# Altium project AP33771.PrjPcb
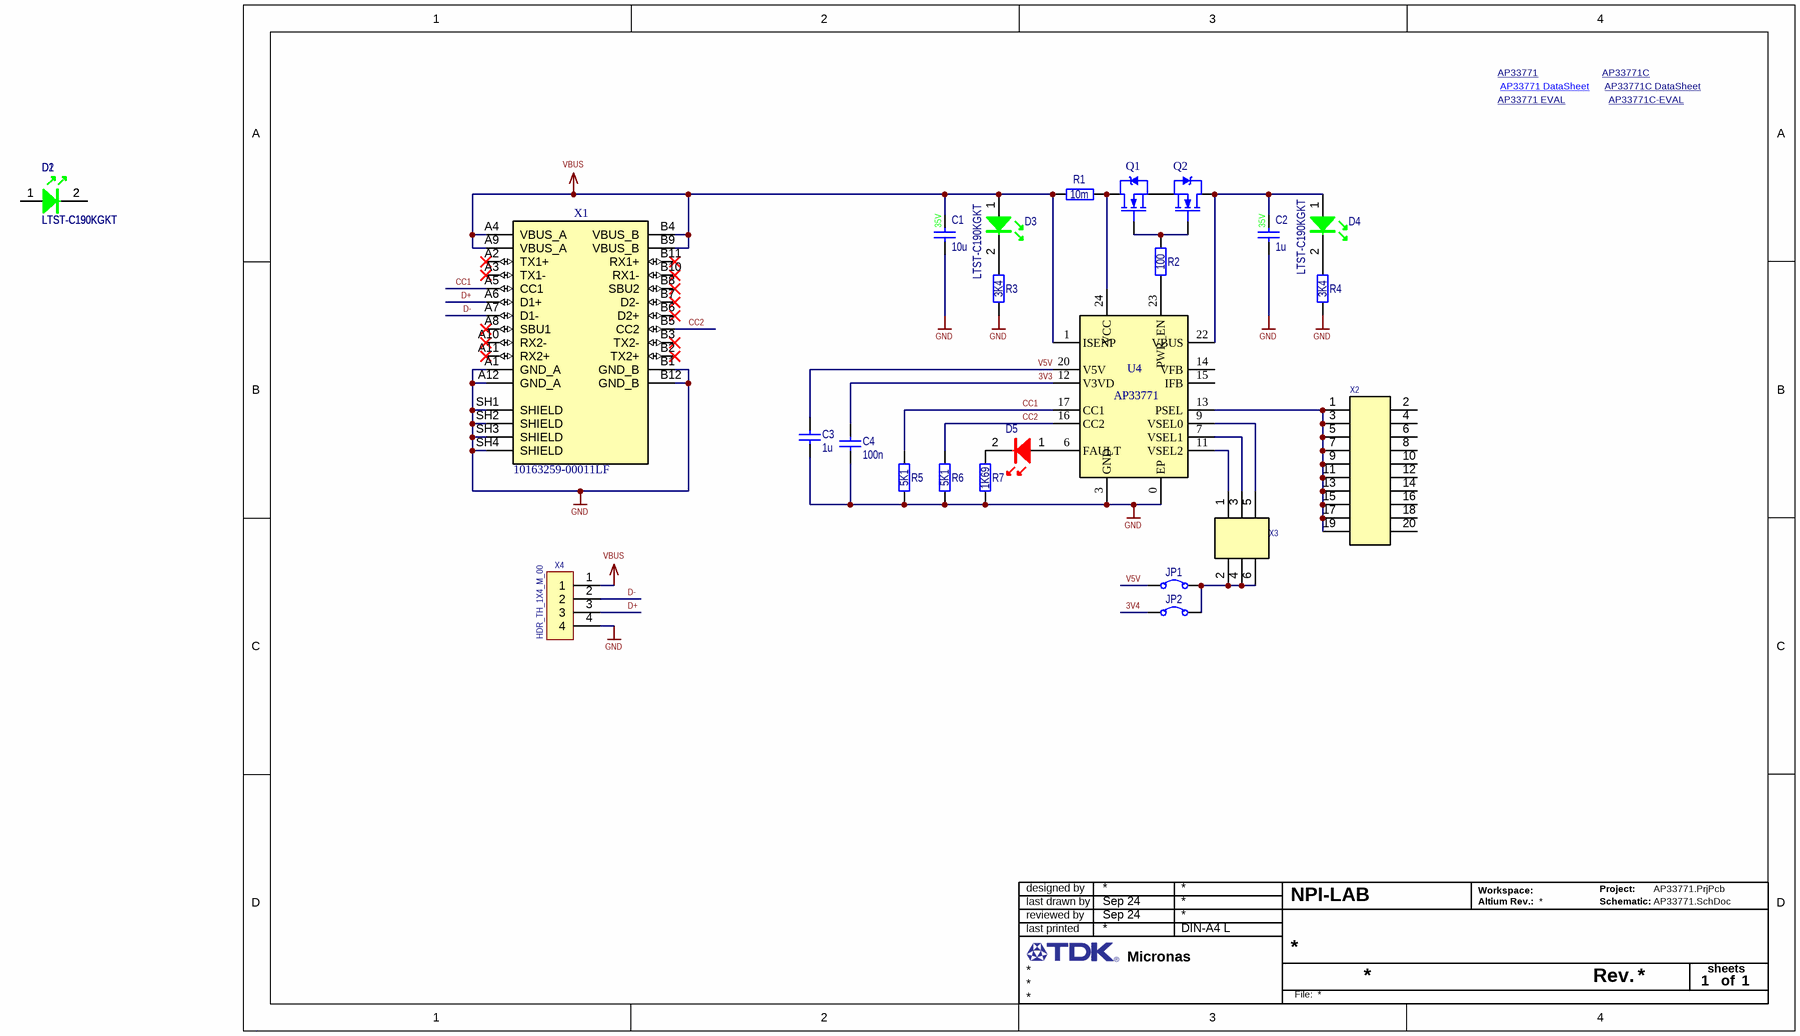
[diagram p0: AP33771.SchDoc]
companyName: Micronas; Date_Designed: May 2024; Date_Drawn: May 2024; Date_Engineer: Sep 24; Date_Reviewed: June 2024; DateChecked: Sep 24; DateDraw: Sep 24; Draftsman: Hören; Engineer_Desing: nerohmot; Engineer_Drawn: nerohmot; Engineer_Review: heli2src; organization: NPI-LAB; Project_Title: Babel Box
1 sheet, 25 parts. Net scope: global (net labels, ports and power ports of the same name join across sheets).
Board file: AP33771.PcbDoc

## Sheet AP33771.SchDoc
size A4; SheetNumber: 1; SheetTotal: 1

### Parts
C1  35V  value 10u  [CAPC0603]
C2  35V  value 1u  [CAPC0603]
C3  value 1u  [CAPC0402]  (hidden comment: CL05A105KP5NNNC)
C4  value 100n  [CAPC0402]  (hidden comment: C0402C104J8RACTU)
D1  LTST-C190KGKT  [LED0603G]
D2  LTST-C190KGKT  [LED0603G]
D3  LTST-C190KGKT  [LED0603G]
D4  LTST-C190KGKT  [LED0603G]
D5  LTST-C190KGKT  [LED0603R]  (value not drawn)
JP1  5110 Keystone  [JumperSMD_0603]  (value not drawn)  (no BOM)
JP2  5110 Keystone  [JumperSMD_0603]  (value not drawn)  (no BOM)
Q1  DMN3008SFG  [PowerDI3333-8]  (value not drawn)
Q2  DMN3008SFG  [PowerDI3333-8]  (value not drawn)
R1  value 10m  [RESC1206]  (hidden comment: 10m_1206_63mW_1%_100ppm_1)
R2  value 100  [RESC0402]  (hidden comment: 100R_0402_63mW_1%_100ppm_1)
R3  value 3K4  [RESC0402]  (hidden comment: 3K4_0402_63mW_1%_100ppm)
R4  value 3K4  [RESC0402]  (hidden comment: 3K4_0402_63mW_1%_100ppm)
R5  value 5K1  [RESC0402]  (hidden comment: 5K1_0402_63mW_1%_100ppm)
R6  value 5K1  [RESC0402]  (hidden comment: 5K1_0402_63mW_1%_100ppm)
R7  value 1K69  [RESC0402]  (hidden comment: 1K69_0402_63mW_1%_100ppm)
U4  AP33771  [W-QFN4040-24]
X1  value 10163259-00011LF  [10163259-00011LF]  (hidden comment: USBC)
X2  HMTSW-110-07-G-D-240  [HDR_TH_2X10_M_00]  (value not drawn)
X3  HMTSW-103-07-G-D-240  [HDR_TH_2X3_M_00]  (value not drawn)
X4  value HDR_TH_1X4_M_00  [HDR_TH_1X4_M_00]  (hidden comment: HMTSW-104-07-G-S-240)

### Nets
GND: C1.1 C2.1 C3.1 C4.1 R3.1 R4.1 R5.1 R6.1 R7.1 U4.0(EP) U4.3(GND) X1.A1(GND_A) X1.A12(GND_A) X1.B1(GND_B) X1.B12(GND_B) X1.SH1(SHIELD) X1.SH2(SHIELD) X1.SH3(SHIELD) X1.SH4(SHIELD) X4.4
VBUS: C1.2 D3.1(A) R1.1 U4.1(ISENP) X1.A4(VBUS_A) X1.A9(VBUS_A) X1.B4(VBUS_B) X1.B9(VBUS_B) X4.1
3V3: C4.2 U4.12(V3VD)
3V4: JP2.1
CC1: R5.2 U4.17(CC1) X1.A5(CC1)
CC2: R6.2 U4.16(CC2) X1.B5(CC2)
D+: X1.A6(D1+) X4.3
D-: X1.A7(D1-) X4.2
V5V: C3.2 JP1.1 U4.20(V5V)
NetC2_2: C2.2 D4.1(A) Q2.3(D) U4.22(VBUS)
NetD1_1: D1.1(A) D2.1(A)
NetD1_2: D1.2(K) D2.2(K)
NetD3_2: D3.2(K) R3.2
NetD4_2: D4.2(K) R4.2
NetD5_1: D5.1(A) U4.6(FAULT)
NetD5_2: D5.2(K) R7.2
NetJP1_2: JP1.2 JP2.2 X3.2 X3.4 X3.6
NetQ1_1: Q1.1(G) Q2.1(G) R2.2
NetQ1_2: Q1.2(S) Q2.2(S)
NetQ1_3: Q1.3(D) R1.2 U4.24(VCC)
NetR2_1: R2.1 U4.23(PWR_EN)
NetU4_7: U4.7(VSEL1) X3.3
NetU4_9: U4.9(VSEL0) X3.5
NetU4_11: U4.11(VSEL2) X3.1
NetU4_13: U4.13(PSEL) X2.1 X2.3 X2.5 X2.7 X2.9 X2.11 X2.13 X2.15 X2.17 X2.19

Not connected (* = marked no-connect by the designer): U4 14(VFB) 15(IFB); X1 A2(TX1+)* A3(TX1-)* A8(SBU1)* A10(RX2-)* A11(RX2+)* B2(TX2+)* B3(TX2-)* B6(D2+)* B7(D2-)* B8(SBU2)* B10(RX1-)* B11(RX1+)*; X2 2 4 6 8 10 12 14 16 18 20

### Notes on the sheet
- AP33771 <https://www.diodes.com/search/?q=AP33771&t=keyword&action_results=Go>
- AP33771 EVAL <https://www.diodes.com/assets/Evaluation-Boards/AP33771-EVB-User-Guide.pdf>
- AP33771 DataSheet <https://www.diodes.com/assets/Datasheets/AP33771.pdf>
- AP33771C <https://www.diodes.com/search/?q=AP33771C&t=keyword&action_results=Go>
- AP33771C-EVAL <https://www.diodes.com/assets/Evaluation-Boards/AP33771C-Sink-Controller-EVB-User-Guide.pdf>
- AP33771C DataSheet <https://www.diodes.com/datasheet/download/AP33771C.pdf>
- designed by
- reviewed by
- last drawn by
- Workspace:
- Altium Rev.:
- Project:
- Schematic:
- last printed
- DIN-A4 L
- Rev.
- sheets
- of
- File:

### Library data of the parts
C1 = 10u_0603_35V_X5R_20%: Capacitor; X5R; 10u; 0603; 35V; 20%; -55°C ~ 85°C; Manufacturer: Murata Electronics; Manufacturer Part Number: GRM188R6YA106MA73D; Supplier 1: DigiKey; Supplier Part Number 1: 490-13248-1-ND; ComponentLink1Description: Datasheet; ComponentLink1URL: https://search.murata.co.jp/Ceramy/image/img/A01X/G101/ENG/GRM188R6YA106MA73-01A.pdf; ComponentLink2Description: Supplier Info; ComponentLink2URL: https://www.digikey.de/en/products/detail/murata-electronics/GRM188R6YA106MA73D/5877411
C2 = 1u_0603_35V_X7R_10%: Capacitor; X7R; 1u; 0603; 35V; 10%; -55°C ~ 125°C; Manufacturer: Taiyo Yuden; Manufacturer Part Number: GMK107AB7105KAHT; Supplier 1: DigiKey; Supplier Part Number 1: 587-3352-1-ND; ComponentLink1Description: Datasheet; ComponentLink1URL: https://www.yuden.co.jp/productdata/catalog//mlcc11_hq_e.pdf; ComponentLink2Description: Supplier Info; ComponentLink2URL: https://www.digikey.de/en/products/detail/taiyo-yuden/GMK107AB7105KAHT/4157322
C3 = 1u_0402_10V_X5R_10%: Capacitor; Ceramic; 1u; 0402; 10V; X5R; 10%; -55°C ~ 85°C; Manufacturer: Samsung Electro-Mechanics; Manufacturer Part Number: CL05A105KP5NNNC; Supplier 1: DigiKey; Supplier Part Number 1: 1276-1076-6-ND; ComponentLink1Description: Datasheet; ComponentLink1URL: https://www.samsungsem.com/resources/file/global/support/product_catalog/MLCC.pdf; ComponentLink2Description: Supplier Info; ComponentLink2URL: https://www.digikey.com/en/products/detail/samsung-electro-mechanics/CL05A105KP5NNNC/3886734?s=N4IgTCBcDaIIxgOwDYC0cAMLVoHIBEQBdAXyA
C4 = 100n_0402_10V_X7R_5%: Capacitor; Ceramic; 100n; 0402; 10V; X7R; 5%; -55°C ~ 125°C; Manufacturer: KEMET; Manufacturer Part Number: C0402C104J8RACTU; Supplier 1: DigiKey; Supplier Part Number 1: 399-8942-6-ND; ComponentLink1Description: Datasheet; ComponentLink1URL: https://content.kemet.com/datasheets/KEM_C1002_X7R_SMD.pdf; ComponentLink2Description: Supplier Info; ComponentLink2URL: https://www.digikey.com/en/products/detail/kemet/C0402C104J8RACTU/2196231?s=N4IgTCBcDaIMwE4EFoAcCAsZkDZkDkAREAXQF8g
D1-D4 = LED_GN_LTST-C190KGKT: LED; Green; 571nm; SMD; 0603; Manufacturer: Lite-On Inc.; Manufacturer Part Number: LTST-C190KGKT; ComponentLink4Description: Supplier Info; ComponentLink4URL: https://www.digikey.bg/en/products/detail/liteon/LTST-C190KGKT/386815; ComponentLink5Description: Datasheet; ComponentLink5URL: https://optoelectronics.liteon.com/upload/download/DS22-2000-074/LTST-C190KGKT.PDF; Supplier 1: Digi-Key; Supplier Part Number 1: 160-1435-1-ND; Value: LTST-C190KGKT
D5 = LED_GN_LTST-C190KRKT: LED; RED; 571nm; SMD; 0603; Manufacturer: Lite-On Inc.; Manufacturer Part Number: LTST-C190KRKT; ComponentLink4Description: Supplier Info; ComponentLink4URL: https://www.digikey.de/en/products/detail/liteon/LTST-C190KRKT/386817; ComponentLink5Description: Datasheet; ComponentLink5URL: https://optoelectronics.liteon.com/upload/download/DS-22-99-0151/LTST-C190KRKT.pdf; Supplier 1: Digi-Key; Supplier Part Number 1: 160-1436-1-ND
JP1 JP2 = JMP_0R_0603: Jumper; Chip; 0R; 0603; 500mW; Manufacturer Part Number: 5110; ComponentLink1Description: Datasheet; ComponentLink1URL: https://www.keyelco.com/userAssets/file/M65p54.pdf; ComponentLink2Description: Supplier Info; ComponentLink2URL: https://www.digikey.com/en/products/detail/keystone-electronics/5110/5118870?s=N4IgTCBcDaINIFMCeBnALgewHYIAQFYBGQgBhAF0BfIA; Manufacturer: Keystone; Supplier 1: DigiKey; Supplier Part Number 1: 36-5110CT-ND; Value: 0R
Q1 Q2 = DMN3008SFG: MOSFET N-CH 30V 16A PWRDI3333; Manufacturer: Diodes Incorporated; Manufacturer Part Number: DMN3008SFG-7; ComponentLink1Description: Datasheet; ComponentLink1URL: https://www.diodes.com/assets/Datasheets/DMN3008SFG.pdf; ComponentLink2Description: Supplier Info; ComponentLink2URL: https://www.digikey.de/en/products/detail/diodes-incorporated/DMN3008SFG-7/4967038; Supplier 1: DigiKey; Supplier Part Number 1: DMN3008SFG-7DICT-ND
R1 = 10m_1206_63mW_1%_100ppm_1: Resistor; Chip; 10mR; 1206; 1%; 100ppm; 1W; -55°C ~ 170°C; Manufacturer: YAGEO; Manufacturer Part Number: PE1206FRF470R01L; Supplier 1: DigiKey; ComponentLink1Description: Datasheet; ComponentLink1URL: https://www.yageo.com/upload/media/product/app/datasheet/rchip/pyu-pe_521_rohs_l.pdf; ComponentLink2Description: Supplier Info; ComponentLink2URL: https://www.digikey.de/en/products/detail/yageo/PE1206FRF470R01L/5914343; Supplier Part Number 1: 13-PE1206FRF470R01LCT-ND
R2 = 100R_0402_63mW_1%_100ppm_1: Resistor; Chip; 100R; 0402; 1%; 100ppm; 63mW; -55°C ~ 155°C; Manufacturer 1: YAGEO; Manufacturer Part Number 1: RC0402FR-07100RL; Supplier 1: DigiKey; ComponentLink1Description: Datasheet; ComponentLink1URL: https://www.yageo.com/upload/media/product/products/datasheet/rchip/PYu-RC_Group_51_RoHS_L_12.pdf; ComponentLink2Description: Supplier Info; ComponentLink2URL: https://www.digikey.de/en/products/detail/yageo/RC0402FR-07100RL/726527; Supplier Part Number 1: 311-100LRCT-ND
R3 R4 = 3K4_0402_63mW_1%_100ppm: Resistor; Chip; 3K4; 0402; 1%; 100ppm; 63mW; -55°C ~ 155°C; Manufacturer: YAGEO; Manufacturer Part Number: AC0402FR-073K4L; Supplier 1: DigiKey; Supplier Part Number 1: YAG5668CT-ND; ComponentLink1Description: Datasheet; ComponentLink1URL: https://www.yageo.com/upload/media/product/productsearch/datasheet/rchip/PYu-AC_51_RoHS_L_10.pdf; ComponentLink2Description: Supplier Info; ComponentLink2URL: https://www.digikey.de/en/products/detail/yageo/AC0402FR-073K4L/5895327
R5 R6 = 5K1_0402_63mW_1%_100ppm: Resistor; Chip;  5K1; 0402; 1%; 100ppm; 63mW; -55°C ~ 155°C; Manufacturer 1: YAGEO; Manufacturer Part Number 1: RC0402FR-075K1L; Supplier 1: DigiKey; ComponentLink1Description: Datasheet; ComponentLink1URL: https://www.yageo.com/upload/media/product/products/datasheet/rchip/PYu-RC_Group_51_RoHS_L_12.pdf; ComponentLink2Description: Supplier Info; ComponentLink2URL: https://www.digikey.de/en/products/detail/yageo/RC0402FR-075K1L/726624; Supplier Part Number 1: 311-5.10KLRCT-ND
R7 = 1K69_0402_63mW_1%_100ppm: Resistor; Chip; 1K69; 0402; 1%; 100ppm; 63mW; -55°C ~ 155°C; Manufacturer 1: YAGEO; Manufacturer Part Number 1: RC0402FR-071K69L; Supplier 1: DigiKey; ComponentLink1Description: Datasheet; ComponentLink1URL: https://www.yageo.com/upload/media/product/products/datasheet/rchip/PYu-RC_Group_51_RoHS_L_12.pdf; ComponentLink2Description: Supplier Info; ComponentLink2URL: https://www.digikey.de/en/products/detail/yageo/RC0402FR-071K69L/5280904; Supplier Part Number 1: YAG3044CT-ND
U4 = AP33771: USB PD SINK CONTROLLER; Manufacturer: Diodes Incorporated; Manufacturer Part Number: AP33771DKZ-13; ComponentLink1Description: Datasheet; ComponentLink1URL: https://www.diodes.com/assets/Datasheets/AP33771.pdf; ComponentLink2Description: Supplier Info; ComponentLink2URL: https://www.digikey.de/en/products/detail/diodes-incorporated/AP33771DKZ-13/15995287; Supplier 1: DigiKey; Supplier Part Number 1: 31-AP33771DKZ-13CT-ND
X1 = 10163259-00011LF: USB 3.2 TYPE C GEN 2 RECEPTACLE; Manufacturer: Amphenol ICC (FCI); ComponentLink1Description: Datasheet; ComponentLink1URL: https://cdn.amphenol-cs.com/media/wysiwyg/files/documentation/datasheet/inputoutput/io_usb_type_c_connector_cable.pdf; ComponentLink2Description: Supplier Info; ComponentLink2URL: https://www.digikey.de/en/products/detail/amphenol-cs-fci/10163259-00011LF/18443707; Manufacturer Part Number: 10163259-00011LF; Supplier 1: DigiKey; Supplier Part Number 1: 609-10163259-00011LFCT-ND
X2 = HDR_TH_2X10_M_00: Header; 2x10 pins; Male; Straight; Pitch 2.54mm; Samtec HMTSW Series; Manufacturer: Samtec Inc.; Manufacturer Part Number: HMTSW-148-07-G-S-240; ComponentLink1Description: Supplier Info; ComponentLink2Description: Datasheet; ComponentLink2URL: https://www.samtec.com/products/hmtsw-148-07-g-s-240
X3 = HDR_TH_2X3_M_00_1: Header; 2x3 pins; Male; Straight; Pitch 2.54mm; Samtec HMTSW Series; Manufacturer: Samtec Inc.; Manufacturer Part Number: HMTSW-148-07-G-S-240; ComponentLink1Description: Supplier Info; ComponentLink2Description: Datasheet; ComponentLink2URL: https://www.samtec.com/products/hmtsw-148-07-g-s-240
X4 = HDR_TH_1X4_M_00: Header; 1x4 pins; Male; Straight; Pitch 2.54mm; Samtec HMTSW Series; Manufacturer: Samtec Inc.; ComponentLink1Description: Supplier Info; ComponentLink1URL: https://www.digikey.de/en/products/detail/samtec-inc/HMTSW-104-07-G-S-240/8450698; ComponentLink2Description: Datasheet; ComponentLink2URL: https://mm.digikey.com/Volume0/opasdata/d220001/medias/docus/6129/hmtsw-xxx-xx-xxx-x-xxxx-xx-xx-mkt.pdf; Manufacturer Part Number: HMTSW-104-07-G-S-240; Supplier 1: Digi-Key; Supplier Part Number 1: HMTSW-104-07-G-S-240-ND

## Assembly variants
PCBA: not fitted JP1 JP1 JP2 JP2 JP3 JP4 JP4 JP5 JP6 JP8 JP12 JP13 JP14 JP22 JP22 JP23 JP23 JP24 JP24 JP25 JP25 JP26 JP26 JP27 JP27 JP30 JP32 JP33 JP34 JP35 JP36 JP37 JP38 JP39 JP40 JP41 JP42 JP43 JP? X4